# EasyEDA schematic SCH_SPD-NFC.json
TITLE: SPD_NFC; REV: 1.0; Date: 2025-03-08; Sheet: 1/1; Drawn By: martan223; Company: Your Company
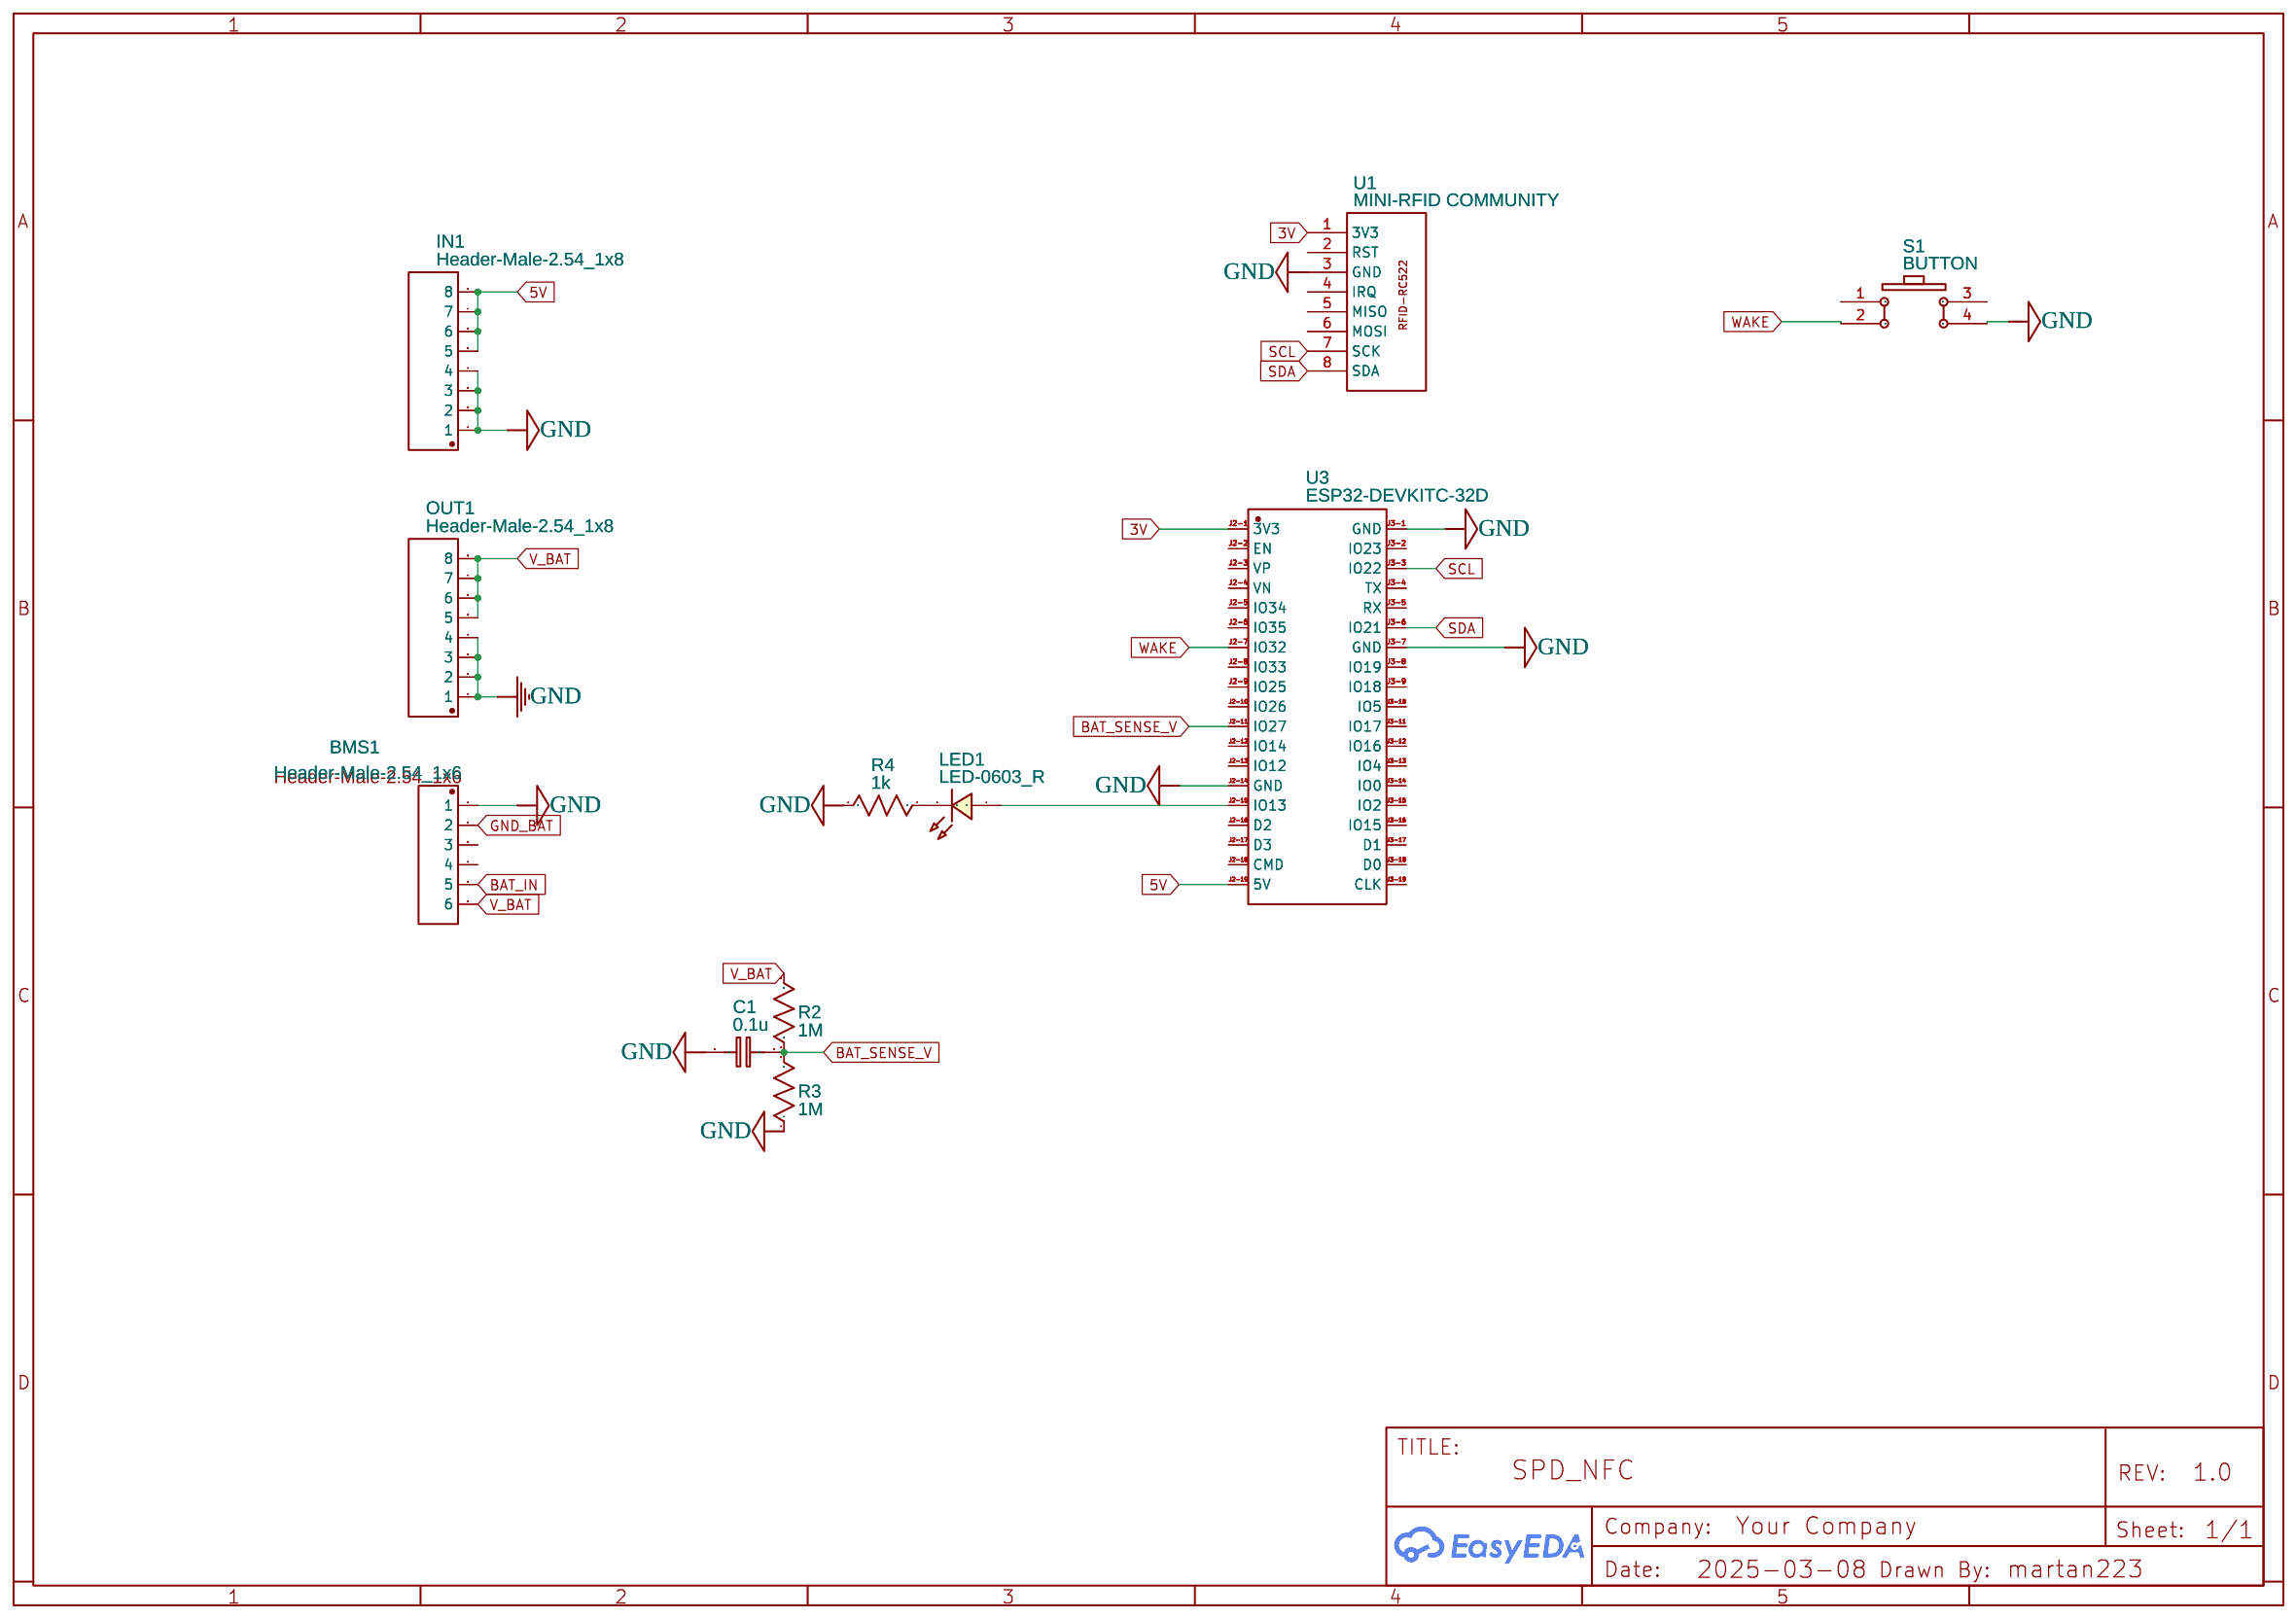
[diagram p0: schematic sheet]

## Parts
BMS1  Header-Male-2.54_1x6  [HEADER-MALE-2.54_1X6]
C1  0.1u  [C0603]
IN1  Header-Male-2.54_1x8  [HDR-TH_8P-P2.54-V-M]
LED1  LED-0603_R  [LED0603_RED]
OUT1  Header-Male-2.54_1x8  [HDR-TH_8P-P2.54-V-M]
R2  1M  [R0603]
R3  1M  [R0603]
R4  1k  [R0603]
S1  BUTTON  [BUTTON]
U1  MINI-RFID COMMUNITY  [MINI-RFID]
U3  ESP32-DEVKITC-32D  [COMM-SMD_ESP32-DEVKITC-32D]

## Library data of the parts
BMS1 = Header-Male-2.54_1x6: Contributor: WDMason
C1 = C_0603_EU: Contributor: LCEDA_Lib
IN1 OUT1 = Header-Male-2.54_1x8: Contributor: LCSC; Supplier: LCSC; Manufacturer: Ckmtw(灿科盟); Supplier Part: C124381; JLCPCB Part Class: Extended Part
LED1 = LED-0603_R: Manufacturer: EVERLIGHT(台湾亿光); Manufacturer Part: 19-217/R6C-AL1M2VY/3T; Supplier Part: C72044; Supplier: LCSC; Contributor: LCEDA_01
R2-R4 = R_0603_US: Contributor: LCEDA_Lib
S1 = BUTTON: Contributor: hoctienganh3341
U1 = MINI-RFID COMMUNITY: Contributor: rafaelangelgg17
U3 = ESP32-DEVKITC-32D: Supplier: LCSC; Supplier Part: C571181; Manufacturer: ESPRESSIF(乐鑫); JLCPCB Part Class: Extended Part; Contributor: lcsc

## Nets
3V: U1.1(3V3) U3.J2-1(3V3)
5V: IN1.5 IN1.6 IN1.7 IN1.8 U3.J2-19(5V)
GND: BMS1.1 C1.1 IN1.1 IN1.2 IN1.3 IN1.4 OUT1.1 OUT1.2 OUT1.3 OUT1.4 R3.1 R4.1 S1.4(3) U1.3(GND) U3.J2-14(GND) U3.J3-1(GND) U3.J3-7(GND)
GND_BAT: BMS1.2
BAT_IN: BMS1.5
BAT_SENSE_V: C1.2 R2.1 R3.2 U3.J2-11(IO27)
SCL: U1.7(SCK) U3.J3-3(IO22)
SDA: U1.8(SDA) U3.J3-6(IO21)
V_BAT: BMS1.6 OUT1.5 OUT1.6 OUT1.7 OUT1.8 R2.2
WAKE: S1.2 U3.J2-7(IO32)
Net-(LED1-1): LED1.1 U3.J2-15(IO13)
Net-(LED1-2): LED1.2 R4.2

Not connected (* = marked no-connect by the designer): BMS1 3 4; S1 1(2) 3; U1 2(RST) 4(IRQ) 5(MISO) 6(MOSI); U3 J2-2(EN) J2-3(VP) J2-4(VN) J2-5(IO34) J2-6(IO35) J2-8(IO33) J2-9(IO25) J2-10(IO26) J2-12(IO14) J2-13(IO12) J2-16(D2) J2-17(D3) J2-18(CMD) J3-2(IO23) J3-4(TX) J3-5(RX) J3-8(IO19) J3-9(IO18) J3-10(IO5) J3-11(IO17) J3-12(IO16) J3-13(IO4) J3-14(IO0) J3-15(IO2) J3-16(IO15) J3-17(D1) J3-18(D0) J3-19(CLK)
